# Altium schematic sheet mcu.SchDoc
size B
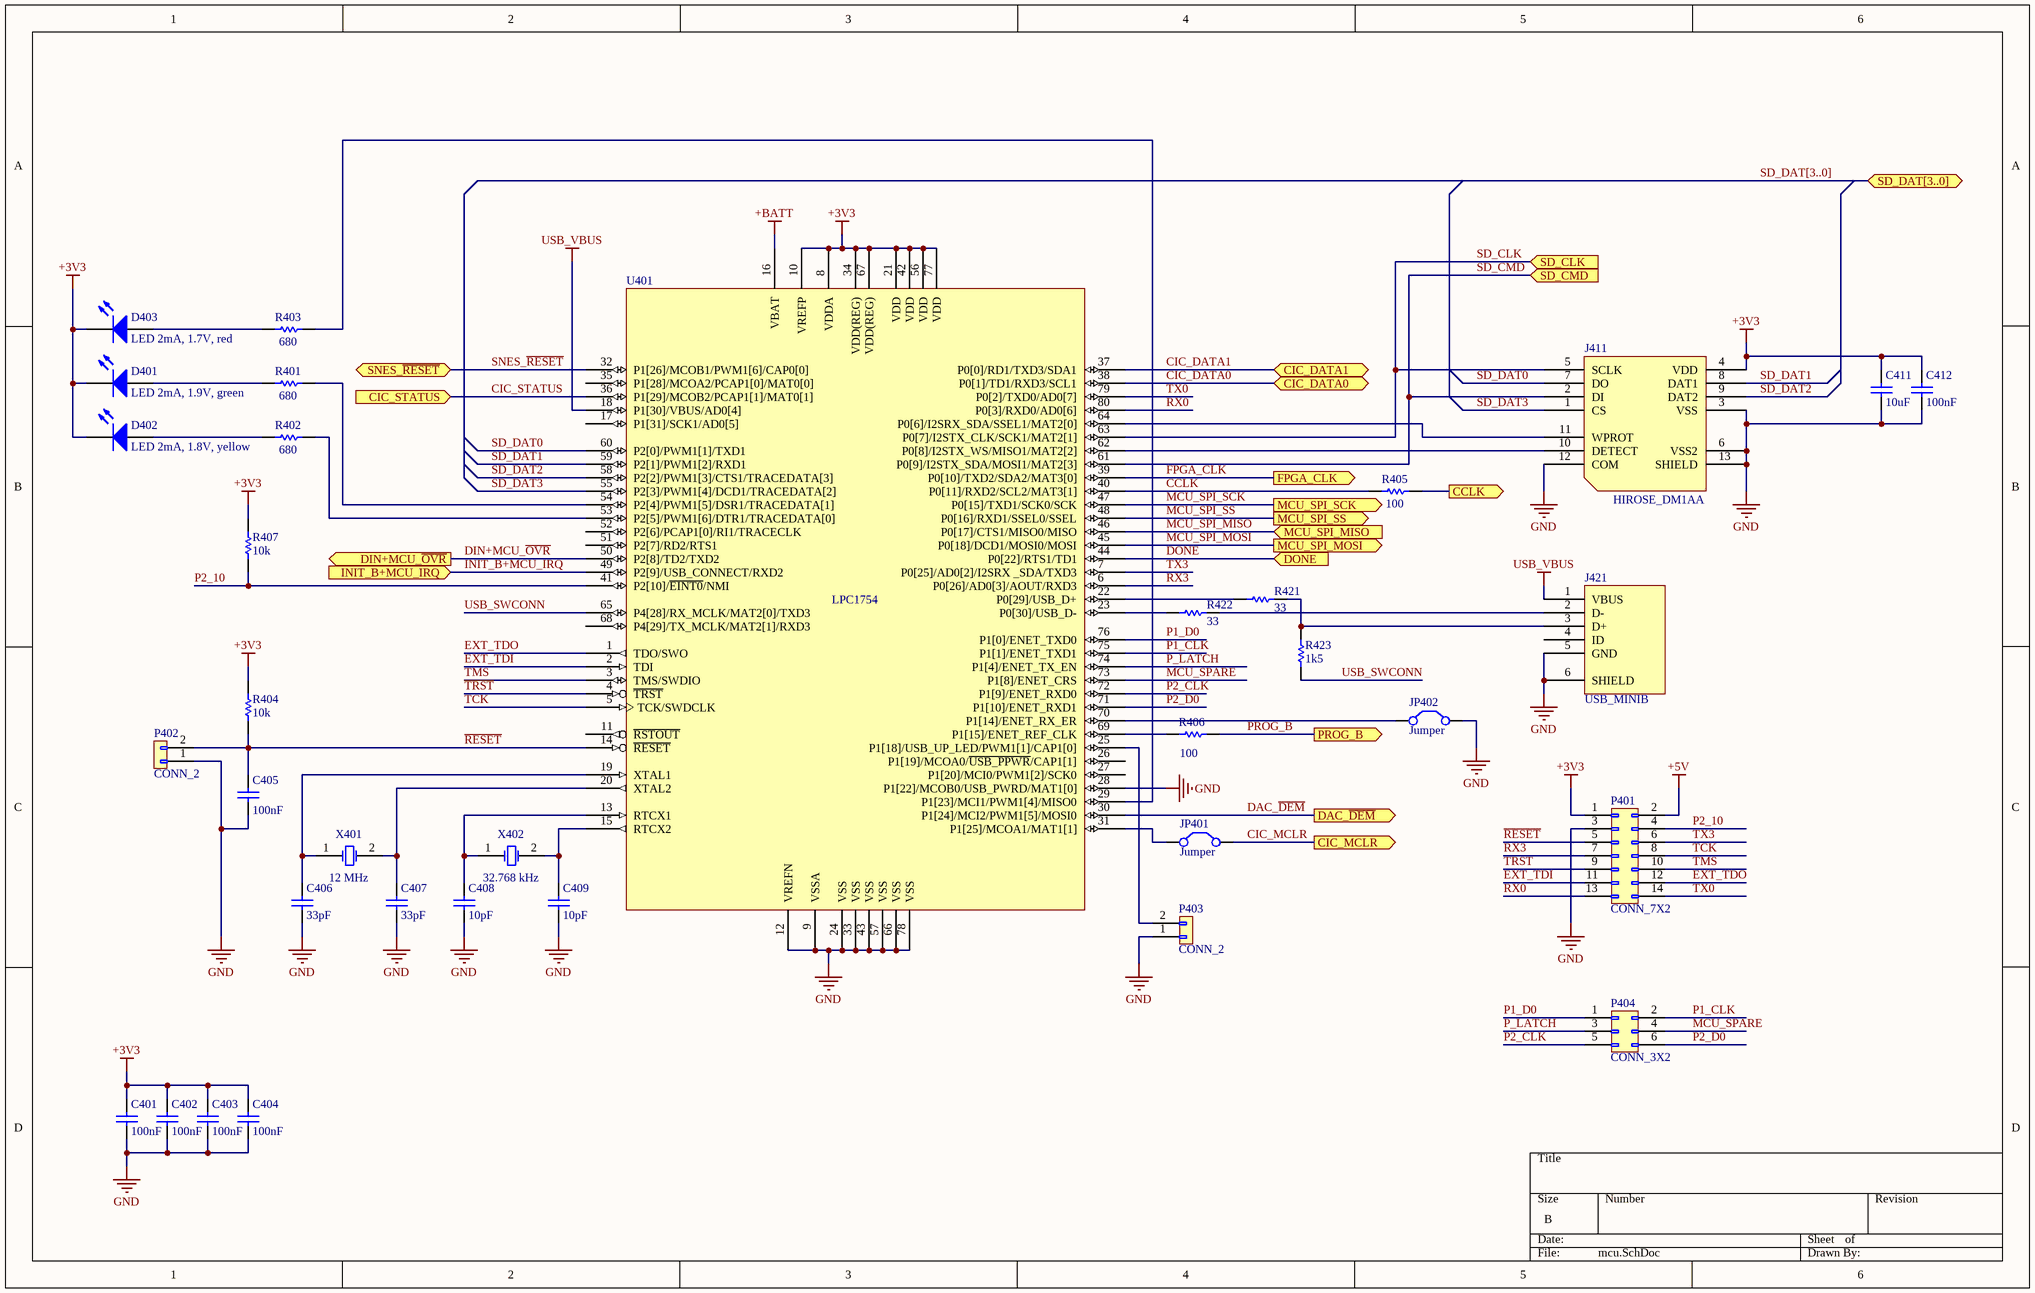
[diagram p0: mcu.SchDoc]

## Parts
C401  100nF  [SM0805]
C402  100nF  [SM0805]
C403  100nF  [SM0805]
C404  100nF  [SM0805]
C405  100nF  [SM0805]
C406  33pF  [SM0805]
C407  33pF  [SM0805]
C408  10pF  [SM0805]
C409  10pF  [SM0805]
C411  10uF  [SM0805]
C412  100nF  [SM0805]
D401  LED 2mA, 1.9V, green  [LED-3MM-FIXED]
D402  LED 2mA, 1.8V, yellow  [LED-3MM-FIXED]
D403  LED 2mA, 1.7V, red  [LED-3MM-FIXED]
J411  HIROSE_DM1AA  [HRS-DM1AA]
J421  USB_MINIB  [USB-MINIB]
JP401  Jumper  [JUMPER]
JP402  Jumper  [JUMPER]
P401  CONN_7X2  [PIN_ARRAY_7X2]
P402  CONN_2  [PIN_ARRAY_2X1]
P403  CONN_2  [PIN_ARRAY_2X1]
P404  CONN_3X2  [PIN_ARRAY_3X2]
R401  680  [SM0805]
R402  680  [SM0805]
R403  680  [SM0805]
R404  10k  [SM0805]
R405  100  [SM0805]
R406  100  [SM0805]
R407  10k  [SM0805]
R421  33  [SM0805]
R422  33  [SM0805]
R423  1k5  [SM0805]
U401  LPC1754  [LQFP80-.5]
X401  12 MHz  [XTAL_SMD_05032]
X402  32.768 kHz  [XTAL_SMD_05019]

## Ports
CCLK (out), CIC_DATA0 (bidir), CIC_DATA1 (bidir), CIC_MCLR (out), CIC_STATUS (in), DAC_~{DEM} (out), DIN+MCU_~{OVR} (out), DONE (in), FPGA_CLK (out), INIT_B+MCU_IRQ (in), MCU_SPI_MISO (in), MCU_SPI_MOSI (out), MCU_SPI_SCK (out), MCU_SPI_SS (out), PROG_B (out), SD_CLK (in), SD_CMD (in), SD_DAT[3..0] (bidir), SNES_~{RESET} (bidir)

## Nets
+3V3: C401.1 C402.1 C403.1 C404.1 C411.1 C412.1 D401.2(K) D402.2(K) D403.2(K) J411.4(VDD) P401.1 R404.2 R407.2 U401.8(VDDA) U401.10(VREFP) U401.21(VDD) U401.34(VDD(REG)) U401.42(VDD) U401.56(VDD) U401.67(VDD(REG)) U401.77(VDD)
+5V: P401.2
+BATT: U401.16(VBAT)
GND: C401.2 C402.2 C403.2 C404.2 C405.2 C406.2 C407.2 C408.2 C409.2 C411.2 C412.2 J411.3(VSS) J411.6(VSS2) J411.12(COM) J411.13(SHIELD) J421.5(GND) J421.6(SHIELD) JP402.1(C1) P401.3 P402.1 P403.1 U401.9(VSSA) U401.12(VREFN) U401.24(VSS) U401.28(P1[22]/MCOB0/USB_PWRD/MAT1[0]) U401.33(VSS) U401.43(VSS) U401.57(VSS) U401.66(VSS) U401.78(VSS)
USB_VBUS: J421.1(VBUS) U401.18(P1[30]/VBUS/AD0[4])
CCLK: R405.2 U401.40(P0[11]/RXD2/SCL2/MAT3[1])
CCLK: R405.1 ; port CCLK  [a separate net that carries the same name]
CIC_DATA0: U401.38(P0[1]/TD1/RXD3/SCL1) ; port CIC_DATA0
CIC_DATA1: U401.37(P0[0]/RD1/TXD3/SDA1) ; port CIC_DATA1
CIC_MCLR: JP401.2(C2) ; port CIC_MCLR
CIC_STATUS: U401.36(P1[29]/MCOB2/PCAP1[1]/MAT0[1]) ; port CIC_STATUS
DAC_~{DEM}: U401.30(P1[24]/MCI2/PWM1[5]/MOSI0) ; port DAC_~{DEM}
DIN+MCU_~{OVR}: U401.50(P2[8]/TD2/TXD2) ; port DIN+MCU_~{OVR}
DONE: U401.44(P0[22]/RTS1/TD1) ; port DONE
EXT_TDI: P401.11 U401.2(TDI)
EXT_TDO: P401.12 U401.1(TDO/SWO)
FPGA_CLK: U401.39(P0[10]/TXD2/SDA2/MAT3[0]) ; port FPGA_CLK
INIT_B+MCU_IRQ: U401.49(P2[9]/USB_CONNECT/RXD2) ; port INIT_B+MCU_IRQ
MCU_SPARE: P404.4 U401.73(P1[8]/ENET_CRS)
MCU_SPI_MISO: U401.46(P0[17]/CTS1/MISO0/MISO) ; port MCU_SPI_MISO
MCU_SPI_MOSI: U401.45(P0[18]/DCD1/MOSI0/MOSI) ; port MCU_SPI_MOSI
MCU_SPI_SCK: U401.47(P0[15]/TXD1/SCK0/SCK) ; port MCU_SPI_SCK
MCU_SPI_SS: U401.48(P0[16]/RXD1/SSEL0/SSEL) ; port MCU_SPI_SS
P1_CLK: P404.2 U401.75(P1[1]/ENET_TXD1)
P1_D0: P404.1 U401.76(P1[0]/ENET_TXD0)
P2_10: P401.4 R407.1 U401.41(P2[10]/~{EINT0}/NMI)
P2_CLK: P404.5 U401.72(P1[9]/ENET_RXD0)
P2_D0: P404.6 U401.71(P1[10]/ENET_RXD1)
P_LATCH: P404.3 U401.74(P1[4]/ENET_TX_EN)
PROG_B: R406.2 ; port PROG_B
~{RESET}: C405.1 P401.5 P402.2 R404.1 U401.14(~{RESET})
RX0: P401.13 U401.80(P0[3]/RXD0/AD0[6])
RX3: P401.7 U401.6(P0[26]/AD0[3]/AOUT/RXD3)
SD_CLK: J411.5(SCLK) U401.63(P0[7]/I2STX_CLK/SCK1/MAT2[1]) ; port SD_CLK
SD_CMD: J411.2(DI) U401.61(P0[9]/I2STX_SDA/MOSI1/MAT2[3]) ; port SD_CMD
SD_DAT0: J411.7(DO) U401.60(P2[0]/PWM1[1]/TXD1)
SD_DAT1: J411.8(DAT1) U401.59(P2[1]/PWM1[2]/RXD1)
SD_DAT2: J411.9(DAT2) U401.58(P2[2]/PWM1[3]/CTS1/TRACEDATA[3])
SD_DAT3: J411.1(CS) U401.55(P2[3]/PWM1[4]/DCD1/TRACEDATA[2])
SNES_~{RESET}: U401.32(P1[26]/MCOB1/PWM1[6]/CAP0[0]) ; port SNES_~{RESET}
~{TRST}: P401.9 U401.4(~{TRST})
TCK: P401.8 U401.5(TCK/SWDCLK)
TMS: P401.10 U401.3(TMS/SWDIO)
TX0: P401.14 U401.79(P0[2]/TXD0/AD0[7])
TX3: P401.6 U401.7(P0[25]/AD0[2]/I2SRX__SDA/TXD3)
USB_SWCONN: R423.1 U401.65(P4[28]/RX_MCLK/MAT2[0]/TXD3)
NetC406_1: C406.1 U401.19(XTAL1) X401.1(OSC1)
NetC407_1: C407.1 U401.20(XTAL2) X401.2(OSC2)
NetC408_1: C408.1 U401.13(RTCX1) X402.1(OSC1)
NetC409_1: C409.1 U401.15(RTCX2) X402.2(OSC2)
NetD401_1: D401.1(A) R401.2
NetD402_1: D402.1(A) R402.2
NetD403_1: D403.1(A) R403.2
NetJ411_10: J411.10(DETECT) U401.62(P0[8]/I2STX_WS/MISO1/MAT2[2])
NetJ411_11: J411.11(WPROT) U401.64(P0[6]/I2SRX_SDA/SSEL1/MAT2[0])
NetJ421_2: J421.2(D-) R422.1
NetJ421_3: J421.3(D+) R421.1 R423.2
NetJP401_1: JP401.1(C1) U401.31(P1[25]/MCOA1/MAT1[1])
NetJP402_2: JP402.2(C2) U401.70(P1[14]/ENET_RX_ER)
NetP403_2: P403.2 U401.25(P1[18]/USB_UP_LED/PWM1[1]/CAP1[0])
NetR401_1: R401.1 U401.54(P2[4]/PWM1[5]/DSR1/TRACEDATA[1])
NetR402_1: R402.1 U401.53(P2[5]/PWM1[6]/DTR1/TRACEDATA[0])
NetR403_1: R403.1 U401.29(P1[23]/MCI1/PWM1[4]/MISO0)
NetR406_1: R406.1 U401.69(P1[15]/ENET_REF_CLK)
NetR421_2: R421.2 U401.22(P0[29]/USB_D+)
NetR422_2: R422.2 U401.23(P0[30]/USB_D-)

Not connected (* = marked no-connect by the designer): J421 4(ID); U401 11(~{RSTOUT}) 17(P1[31]/SCK1/AD0[5]) 26(P1[19]/MCOA0/~{USB_PPWR}/CAP1[1]) 27(P1[20]/MCI0/PWM1[2]/SCK0) 35(P1[28]/MCOA2/PCAP1[0]/MAT0[0]) 51(P2[7]/RD2/RTS1) 52(P2[6]/PCAP1[0]/RI1/TRACECLK) 68(P4[29]/TX_MCLK/MAT2[1]/RXD3)

## Buses and harness runs
bus SD_DAT[3..0] = port SD_DAT[3..0]

## Library data of the parts
C401-C409 C411 C412 = Cap: Capacitor
  C401-C405 C412: Value: 100nF
  C406 C407: Value: 33pF
  C408 C409: Value: 10pF
  C411: Value: 10uF
D401 = LED0: LED, 3mm Round, Diffused, Green
D402 = LED0: LED, 3mm Round, Diffused, Yellow
D403 = LED0: LED, 3mm Round, Diffused, Red
J411 = DM1AA
JP401 JP402 = Jumper: Jumper Wire
R401-R407 R421-R423 = Res1: Resistor
  R401-R403: Value: 680
  R404 R407: Value: 10k
  R405 R406: Value: 100
  R421 R422: Value: 33
  R423: Value: 1k5
X401 X402 = XTAL: Crystal Oscillator